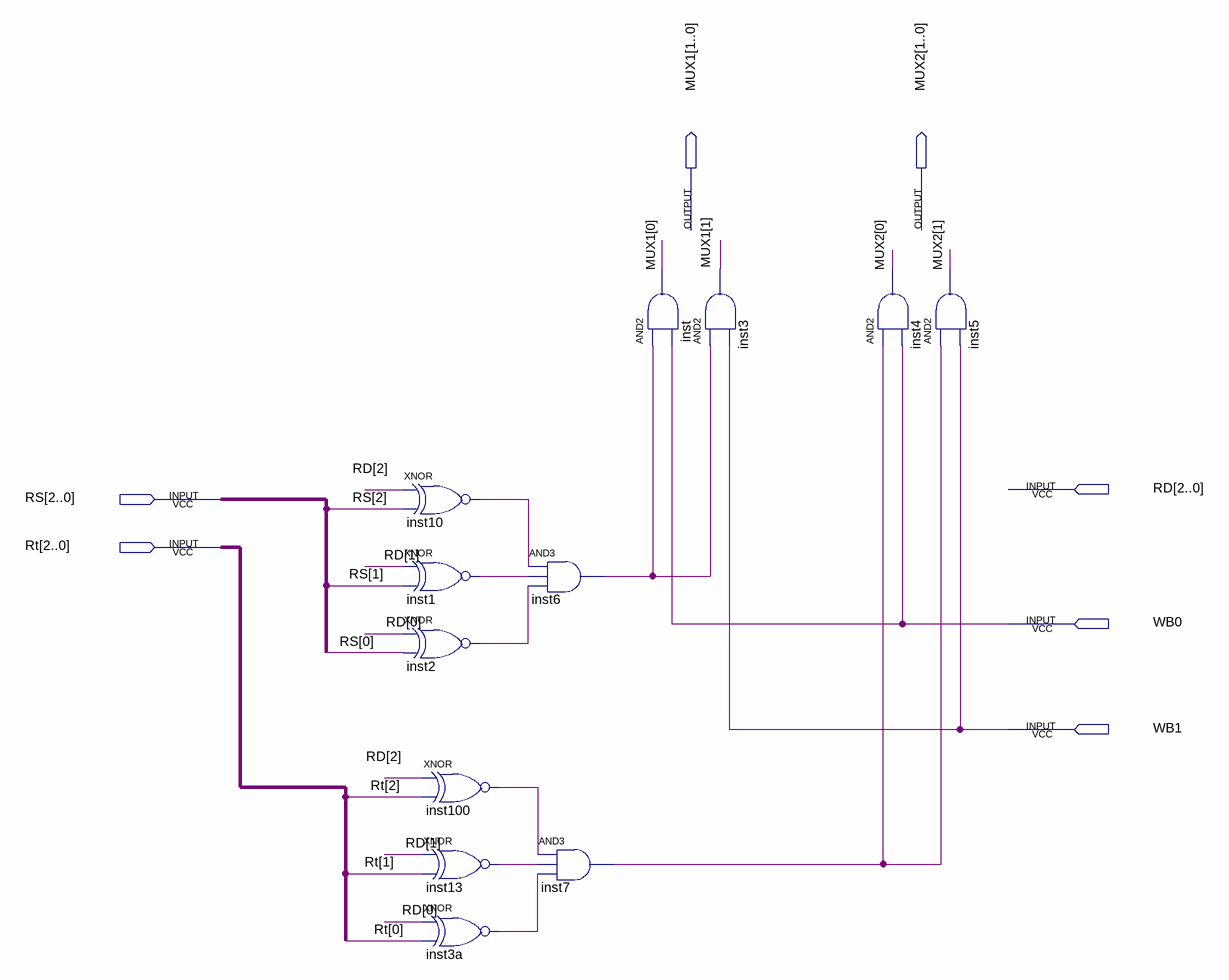
[diagram p0: schematic sheet]
// Quartus schematic ForwardingUnit.bdf as structural Verilog: 12 symbols, 7 pins
module ForwardingUnit (
  input  [2:0] RD,
  input  [2:0] RS,
  input  [2:0] Rt,
  input  WB0,
  input  WB1,
  output [1:0] MUX1,
  output [1:0] MUX2
);

  wire inst1_out, inst2_out, inst3a_out, inst6_out, inst7_out, inst10_out, inst13_out, inst100_out;

  xnor inst10 (inst10_out, RD[2], RS[2]);
  xnor inst1 (inst1_out, RD[1], RS[1]);
  xnor inst2 (inst2_out, RD[0], RS[0]);
  xnor inst100 (inst100_out, RD[2], Rt[2]);
  xnor inst13 (inst13_out, RD[1], Rt[1]);
  xnor inst3a (inst3a_out, RD[0], Rt[0]);
  and inst6 (inst6_out, inst10_out, inst1_out, inst2_out);
  and inst7 (inst7_out, inst100_out, inst13_out, inst3a_out);
  and inst (MUX1[0], inst6_out, WB0);
  and inst3 (MUX1[1], inst6_out, WB1);
  and inst4 (MUX2[0], inst7_out, WB0);
  and inst5 (MUX2[1], inst7_out, WB1);
endmodule
